# Altium schematic sheet Power Budget.SchDoc
size A; SheetNumber: 1; SheetTotal: 1
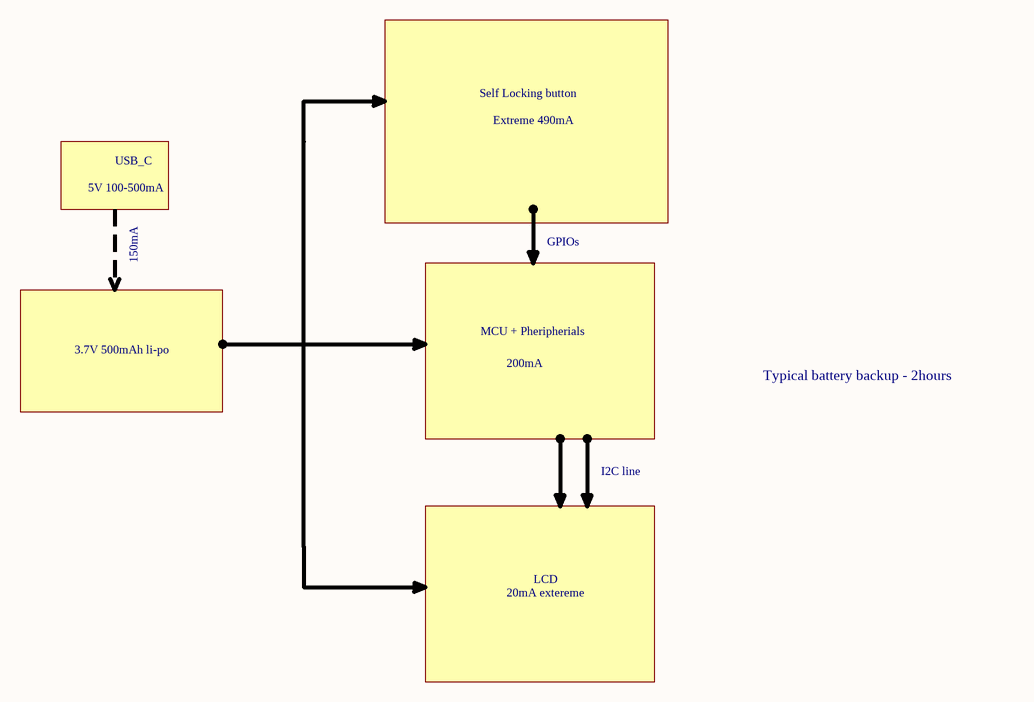
[diagram p0: Power Budget.SchDoc]

## Notes on the sheet
- Self Locking button
- USB_C
- Extreme 490mA
- 5V 100-500mA
- GPIOs
- 150mA
- 3.7V 500mAh li-po
- 200mA
- MCU + Pheripherials
- Typical battery backup - 2hours
- I2C line
- LCD
- 20mA extereme